# Altium schematic sheet LCD.SCHDOC
size A
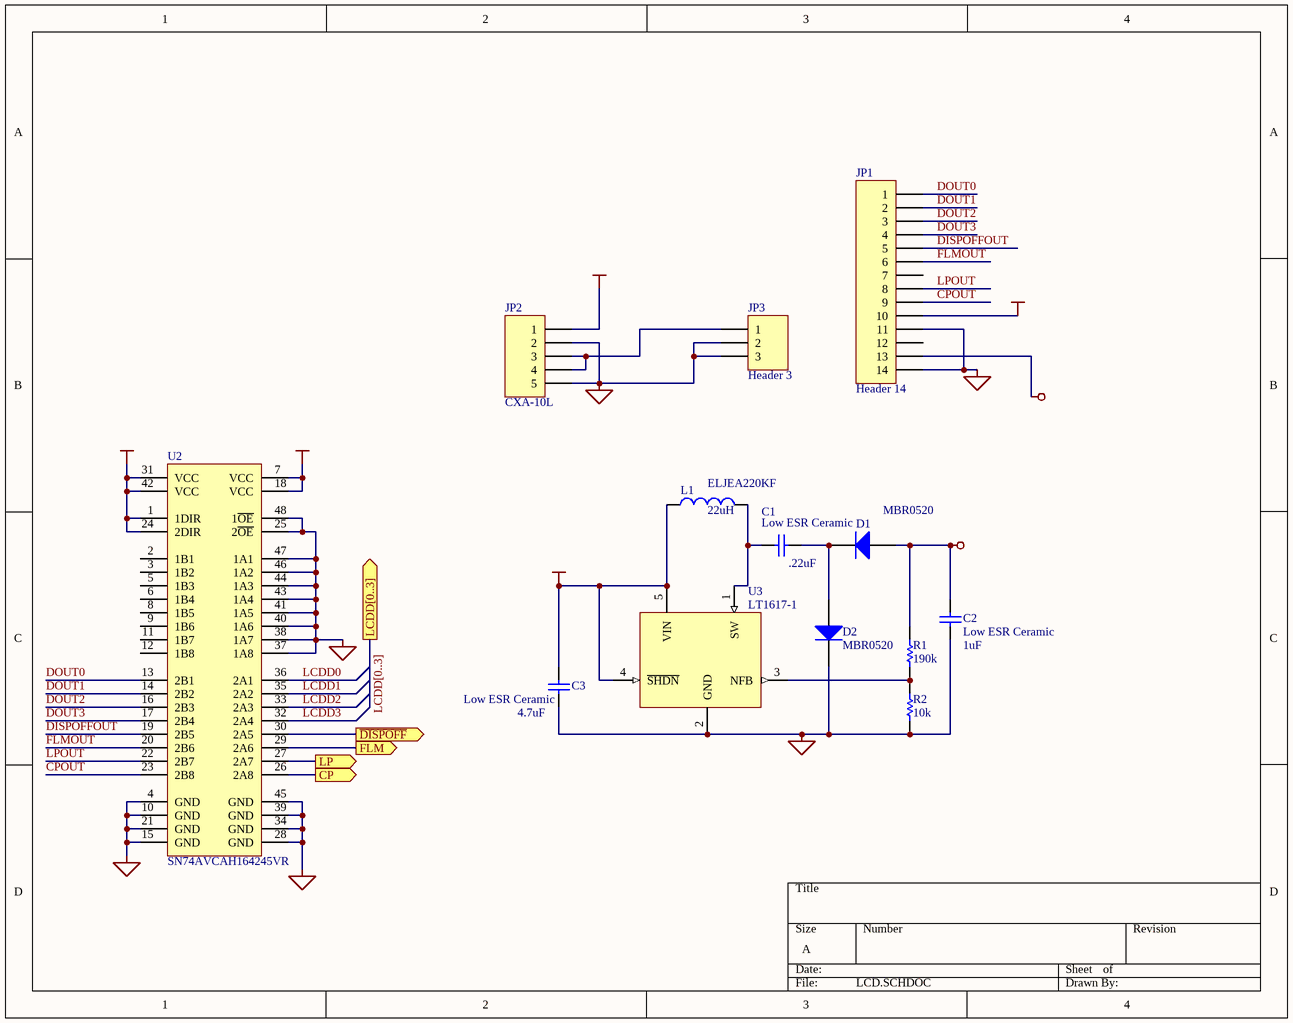
[diagram p0: LCD.SCHDOC]

## Parts
C1  Low ESR Ceramic  value .22uF  [CC3216-1206]
C2  Low ESR Ceramic  value 1uF  [CC3216-1206]
C3  Low ESR Ceramic  value 4.7uF  [CC3216-1206]
D1  MBR0520  [SOD-123]
D2  MBR0520  [SOD-123]
JP1  Header 14  [MOLEX FPC 14-CONN VERT]
JP2  CXA-10L  [CXA-L10L]
JP3  Header 3  [TERMBLOCK3.5x3]
L1  ELJEA220KF  value 22uH  [CC3225-1210]
R1  value 190k  [CC2012-0805]  (hidden comment: Res1)
R2  value 10k  [CC2012-0805]  (hidden comment: Res1)
U2  SN74AVCAH164245VR  [TSSO10x6-G48]
U3  LT1617-1  [SO-G5/P.95]

## Ports
CP (out), FLM (out), LCDD[0..3] (out), LP (out), ~{DISPOFF} (out)

## Nets
+5VCC: JP1.10 JP2.1 U2.7(VCC) U2.18(VCC)
-25VEE: C2.2 D1.1(A) JP1.13 R1.2
GND: C2.1 C3.1 D2.2(K) JP1.11 JP1.14 JP2.2 JP2.5 JP3.2 JP3.3 R2.1 U2.4(GND) U2.10(GND) U2.15(GND) U2.21(GND) U2.25(2~{OE}) U2.28(GND) U2.34(GND) U2.37(1A8) U2.38(1A7) U2.39(GND) U2.40(1A6) U2.41(1A5) U2.43(1A4) U2.44(1A3) U2.45(GND) U2.46(1A2) U2.47(1A1) U2.48(1~{OE}) U3.2(GND)
VCC: C3.2 L1.1 U2.1(1DIR) U2.24(2DIR) U2.31(VCC) U2.42(VCC) U3.4(~{SHDN}) U3.5(VIN)
CP: U2.26(2A8) ; port CP
CPOUT: JP1.9 U2.23(2B8)
~{DISPOFF}: U2.30(2A5) ; port ~{DISPOFF}
DISPOFFOUT: JP1.5 U2.19(2B5)
DOUT0: JP1.1 U2.13(2B1)
DOUT1: JP1.2 U2.14(2B2)
DOUT2: JP1.3 U2.16(2B3)
DOUT3: JP1.4 U2.17(2B4)
FLM: U2.29(2A6) ; port FLM
FLMOUT: JP1.6 U2.20(2B6)
LCDD0: U2.36(2A1)
LCDD1: U2.35(2A2)
LCDD2: U2.33(2A3)
LCDD3: U2.32(2A4)
LP: U2.27(2A7) ; port LP
LPOUT: JP1.8 U2.22(2B7)
NetC1_1: C1.1 D1.2(K) D2.1(A)
NetC1_2: C1.2 L1.2 U3.1(SW)
NetJP2_3: JP2.3 JP2.4 JP3.1
NetR1_1: R1.1 R2.2 U3.3(NFB)

Not connected (* = marked no-connect by the designer): JP1 7 12; U2 2(1B1) 3(1B2) 5(1B3) 6(1B4) 8(1B5) 9(1B6) 11(1B7) 12(1B8)

## Buses and harness runs
bus LCDD[0..3] = port LCDD[0..3]

## Library data of the parts
C1-C3 = Cap: Capacitor; Manufacturer: Generic Components; Class I: Passive; Published: 8-Jun-2000; Revision: July-2002: Re-released for DXP Platform.; Publisher: Altium Limited; Class II: Capacitor
D1 D2 = Diode: Default Diode; Manufacturer: Generic Components; Class I: Discrete; Class II: Diode - Switching; Published: 8-Jun-2000; Revision: July-2002: Re-released for DXP Platform.; Publisher: Altium Limited
JP1 = Header 14: Header, 14-Pin; Manufacturer: Generic Components; Class I: Connector; Revision: July-2002: Re-released for DXP Platform.; Publisher: Altium Limited
JP2 = Header 5: Header, 5-Pin; Manufacturer: Generic Components; Class I: Connector; Revision: July-2002: Re-released for DXP Platform.; Publisher: Altium Limited
JP3 = Header 3: Header, 3-Pin; Manufacturer: Generic Components; Class I: Connector; Revision: July-2002: Re-released for DXP Platform.; Publisher: Altium Limited
L1 = Inductor: Manufacturer: Generic Components; Class I: Passive; Published: 8-Jun-2000; Revision: July-2002: Re-released for DXP Platform.; Publisher: Altium Limited; Class II: Inductor
R1 R2 = Res1: Resistor; Manufacturer: Generic Components; Class I: Passive; Published: 8-Jun-2000; Revision: July-2002: Re-released for DXP Platform.; Publisher: Altium Limited; Class II: Resistor
U2 = SN74LVCH16245A: 16-bit bus transceiver with 3-state outputs
U3 = LT1617: Micropower Inverting DC/DC converter